# Altium schematic sheet MCU.SchDoc
size A4
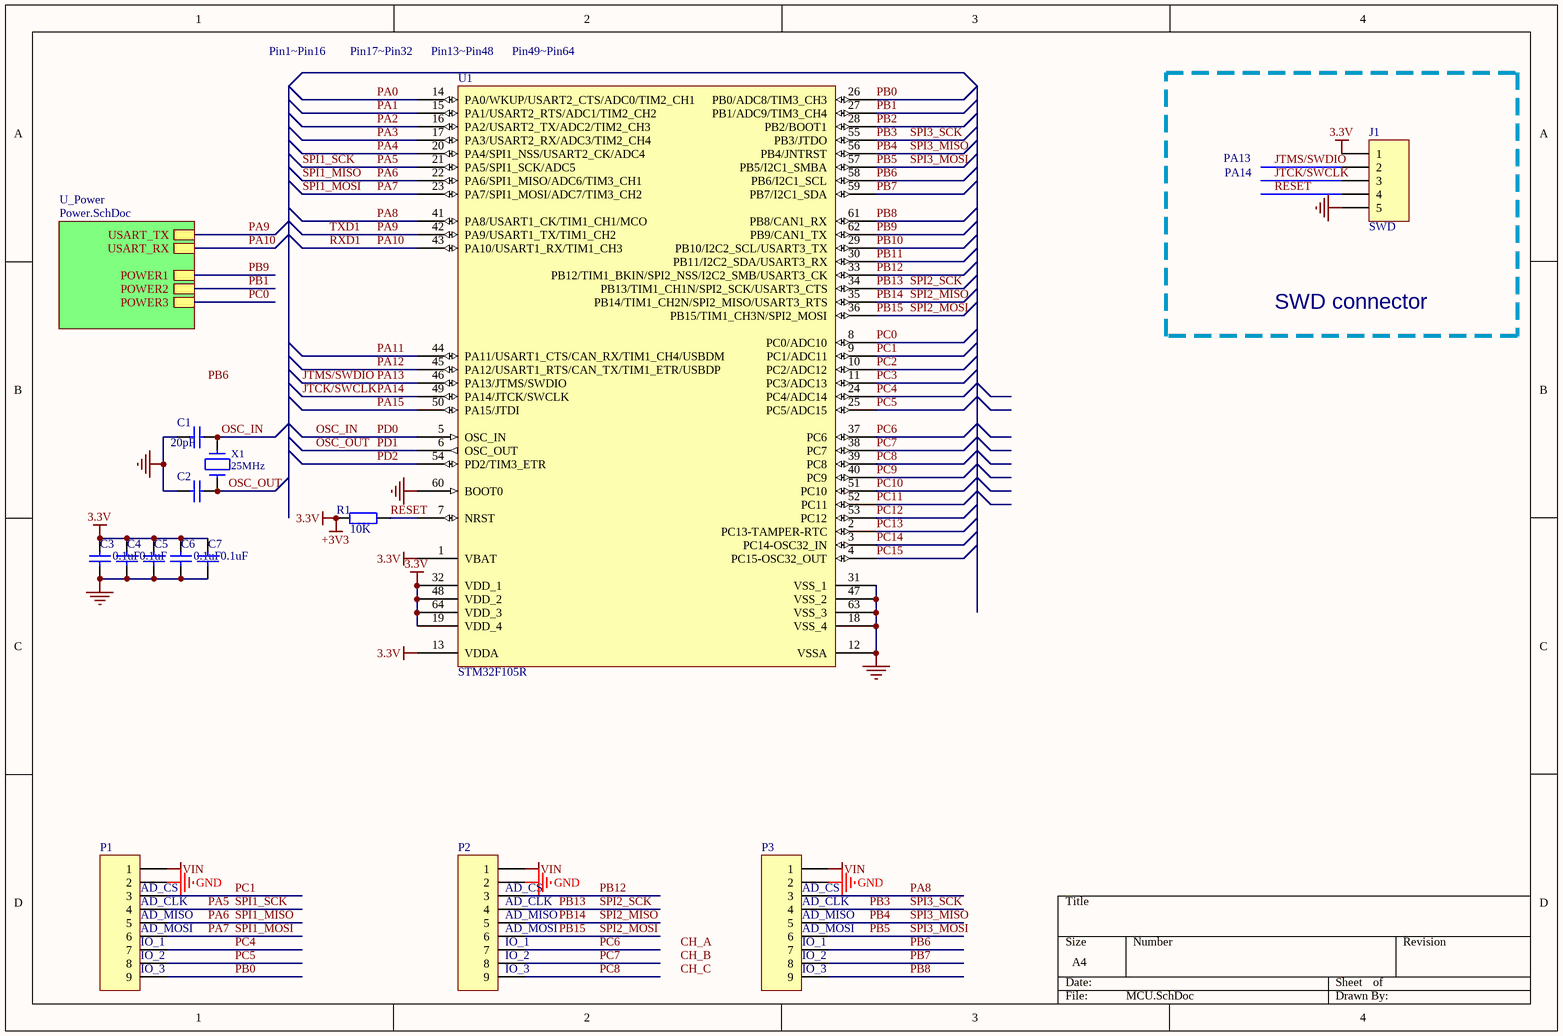
[diagram p0: MCU.SchDoc]

## Parts
C1  20pF  [C2012]
C2  20pF  [C2012]  (value not drawn)
C3  0.1uF  [C2012]
C4  0.1uF  [C2012]
C5  0.1uF  [C2012]  (value not drawn)
C6  0.1uF  [C2012]
C7  0.1uF  [C2012]
J1  SWD  [ch2.5/5]
P1  Header 9  [FPC-9B]  (value not drawn)
P2  Header 9  [FPC-9B]  (value not drawn)
P3  Header 9  [FPC-9B]  (value not drawn)
R1  10K  [2012]
U1  STM32F105R  [LQFP64_M]
X1  25MHz  [SMD2_50X32]

## Blocks framed on the sheet
SWD connector: J1

## Sub-sheets
U_Power = Power.SchDoc: USART_RX, USART_TX, POWER1, POWER2, POWER3

## Nets
+3V3: C3.2 C4.2 C5.2 C6.2 C7.2 J1.1 R1.1 U1.1(VBAT) U1.13(VDDA) U1.19(VDD_4) U1.32(VDD_1) U1.48(VDD_2) U1.64(VDD_3)  [also labelled 3.3V]
GND: C1.2 C2.2 C3.1 C4.1 C5.1 C6.1 C7.1 J1.5 P1.2 P2.2 P3.2 U1.12(VSSA) U1.18(VSS_4) U1.31(VSS_1) U1.47(VSS_2) U1.60(BOOT0) U1.63(VSS_3)
VIN: P1.1 P2.1 P3.1
JTCK/SWCLK: J1.3 U1.49(PA14/JTCK/SWCLK)  [also labelled PA14]
JTMS/SWDIO: J1.2 U1.46(PA13/JTMS/SWDIO)  [also labelled PA13]
OSC_IN: C1.1 U1.5(OSC_IN) X1.2  [also labelled PD0]
OSC_OUT: C2.1 U1.6(OSC_OUT) X1.1  [also labelled PD1]
PA0: U1.14(PA0/WKUP/USART2_CTS/ADC0/TIM2_CH1)
PA1: U1.15(PA1/USART2_RTS/ADC1/TIM2_CH2)
PA2: U1.16(PA2/USART2_TX/ADC2/TIM2_CH3)
PA3: U1.17(PA3/USART2_RX/ADC3/TIM2_CH4)
PA4: U1.20(PA4/SPI1_NSS/USART2_CK/ADC4)
PA5: P1.4 U1.21(PA5/SPI1_SCK/ADC5)  [also labelled SPI1_SCK]
PA6: P1.5 U1.22(PA6/SPI1_MISO/ADC6/TIM3_CH1)  [also labelled SPI1_MISO]
PA7: P1.6 U1.23(PA7/SPI1_MOSI/ADC7/TIM3_CH2)  [also labelled SPI1_MOSI]
PA8: P3.3 U1.41(PA8/USART1_CK/TIM1_CH1/MCO)
PA9: U1.42(PA9/USART1_TX/TIM1_CH2) ; sheet U_Power/USART_TX  [also labelled TXD1]
PA10: U1.43(PA10/USART1_RX/TIM1_CH3) ; sheet U_Power/USART_RX  [also labelled RXD1]
PA11: U1.44(PA11/USART1_CTS/CAN_RX/TIM1_CH4/USBDM)
PA12: U1.45(PA12/USART1_RTS/CAN_TX/TIM1_ETR/USBDP)
PA15: U1.50(PA15/JTDI)
PB0: P1.9 U1.26(PB0/ADC8/TIM3_CH3)
PB1: U1.27(PB1/ADC9/TIM3_CH4) ; sheet U_Power/POWER2
PB2: U1.28(PB2/BOOT1)
PB3: P3.4 U1.55(PB3/JTDO)  [also labelled SPI3_SCK]
PB4: P3.5 U1.56(PB4/JNTRST)  [also labelled SPI3_MISO]
PB5: P3.6 U1.57(PB5/I2C1_SMBA)  [also labelled SPI3_MOSI]
PB6: P3.7 U1.58(PB6/I2C1_SCL)
PB7: P3.8 U1.59(PB7/I2C1_SDA)
PB8: P3.9 U1.61(PB8/CAN1_RX)
PB9: U1.62(PB9/CAN1_TX) ; sheet U_Power/POWER1
PB10: U1.29(PB10/I2C2_SCL/USART3_TX)
PB11: U1.30(PB11/I2C2_SDA/USART3_RX)
PB12: P2.3 U1.33(PB12/TIM1_BKIN/SPI2_NSS/I2C2_SMB/USART3_CK)
PB13: P2.4 U1.34(PB13/TIM1_CH1N/SPI2_SCK/USART3_CTS)  [also labelled SPI2_SCK]
PB14: P2.5 U1.35(PB14/TIM1_CH2N/SPI2_MISO/USART3_RTS)  [also labelled SPI2_MISO]
PB15: P2.6 U1.36(PB15/TIM1_CH3N/SPI2_MOSI)  [also labelled SPI2_MOSI]
PC0: U1.8(PC0/ADC10) ; sheet U_Power/POWER3
PC1: P1.3 U1.9(PC1/ADC11)
PC2: U1.10(PC2/ADC12)
PC3: U1.11(PC3/ADC13)
PC4: P1.7 U1.24(PC4/ADC14)
PC5: P1.8 U1.25(PC5/ADC15)
PC6: P2.7 U1.37(PC6)
PC7: P2.8 U1.38(PC7)
PC8: P2.9 U1.39(PC8)
PC9: U1.40(PC9)
PC10: U1.51(PC10)
PC11: U1.52(PC11)
PC12: U1.53(PC12)
PC13: U1.2(PC13-TAMPER-RTC)
PC14: U1.3(PC14-OSC32_IN)
PC15: U1.4(PC15-OSC32_OUT)
PD2: U1.54(PD2/TIM3_ETR)
RESET: J1.4 R1.2 U1.7(NRST)

## Notes on the sheet
- Pin1~Pin16
- Pin17~Pin32
- (near U1) Pin13~Pin48
- (near U1) Pin49~Pin64
- PA13
- PA14
- (near P1) AD_CS
- (near P1) AD_CLK
- (near P1) AD_MISO
- (near P2) AD_CS
- (near P2) AD_CLK
- (near P2) AD_MISO
- (near P3) AD_CS
- (near P3) AD_CLK
- (near P3) AD_MISO
- (near P1) AD_MOSI
- (near P1) IO_1
- (near P1) IO_2
- (near P1) IO_3
- (near P2) AD_MOSI
- (near P2) IO_1
- (near P2) IO_2
- (near P2) IO_3
- (near P3) AD_MOSI
- (near P3) IO_1
- (near P3) IO_2
- (near P3) IO_3
- Labels drawn without touching a wire or pin: CH_A, CH_B, CH_C, PB6

## Library data of the parts
C1 C2 C6 C7 = Cap: Capacitor; Published: 8-Jun-2000; LatestRevisionDate: 17-Jul-2002; LatestRevisionNote: Re-released for DXP Platform.; PackageReference: RAD-0.3; Publisher: Altium Limited
  C1 C2: Value: 20pF
  C6 C7: Value: 0.1uF
C3-C5 = Cap: Capacitor; Value: 100n; Published: 8-Jun-2000; LatestRevisionDate: 17-Jul-2002; LatestRevisionNote: Re-released for DXP Platform.; PackageReference: RAD-0.3; Publisher: Altium Limited
J1 = Header 5: Header, 5-Pin; LatestRevisionDate: 17-Jul-2002; LatestRevisionNote: Re-released for DXP Platform.; Publisher: Altium Limited
P1-P3 = Header 9: Header, 9-Pin; LatestRevisionDate: 17-Jul-2002; LatestRevisionNote: Re-released for DXP Platform.; Publisher: Altium Limited
R1 = Res2: Resistor; Published: 8-Jun-2000; LatestRevisionDate: 17-Jul-2002; LatestRevisionNote: Re-released for DXP Platform.; PackageReference: AXIAL-0.4; Publisher: Altium Limited; Value: 10K
X1 = CRYSTAL